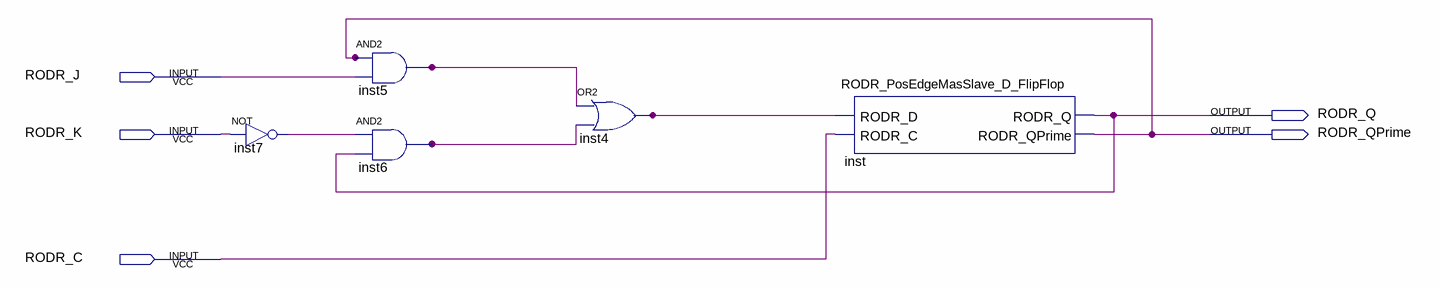
[diagram p0: schematic sheet]
// Quartus schematic RODR_JKFlipFlop.bdf as structural Verilog: 5 symbols, 5 pins
module RODR_JKFlipFlop (
  input  RODR_J,
  input  RODR_K,
  input  RODR_C,
  output RODR_Q,
  output RODR_QPrime
);

  wire inst4_out, inst5_out, inst6_out, inst7_out;

  not inst7 (inst7_out, RODR_K);
  and inst5 (inst5_out, RODR_QPrime, RODR_J);
  and inst6 (inst6_out, inst7_out, RODR_Q);
  or inst4 (inst4_out, inst5_out, inst6_out);
  RODR_PosEdgeMasSlave_D_FlipFlop inst (
    .RODR_D(inst4_out), .RODR_C(RODR_C), .RODR_Q(RODR_Q), .RODR_QPrime(RODR_QPrime));
endmodule
